# Altium schematic sheet PSU.SchDoc
size A3
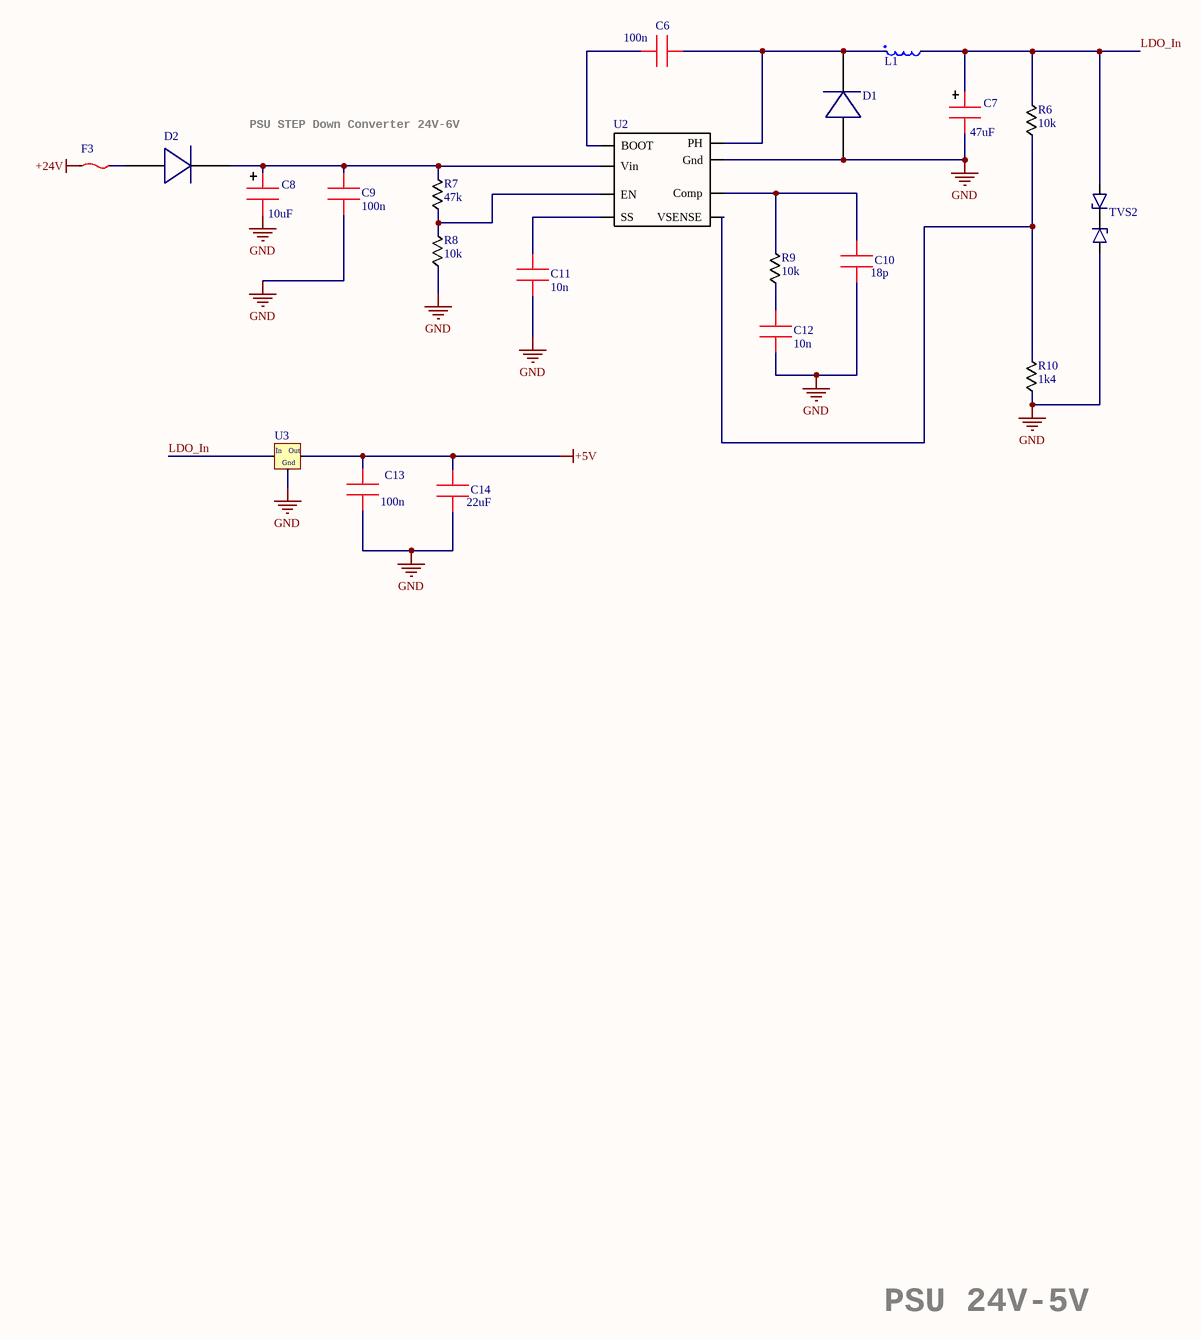
[diagram p0: PSU.SchDoc]

## Parts
C6  100n  [0603 - Cap]
C7  47uF  [1210]
C8  10uF  [1210]
C9  100n  [0603 - Cap]
C10  18p  [0603 - Cap]
C11  10n  [0603 - Cap]
C12  10n  [0603 - Cap]
C13  100n  [0603 - Cap]
C14  22uF  [1206]
D1  (no value)  [B340A-13-F]
D2  (no value)  [B340A-13-F]
F3  (no value)  [MSMF]
L1  (no value)  [SRU1048]
R6  10k  [0603_Res]
R7  47k  [0603_Res]
R8  10k  [0603_Res]
R9  10k  [0603_Res]
R10  1k4  [0603_Res]
TVS2  (no value)  [SM6T]
U2  (no value)  [SOIC 8]
U3  (no value)  [SOT223]

## Nets
+5V: C13.1 C14.2 U3.2(OUT)
+24V: F3.0
GND: C7.2 C8.2 C9.1 C10.1 C11.1 C12.1 C13.2 C14.1 D1.2 R8.1 R10.1 TVS2.1 U2.7(Gnd) U3.1(GND)
LDO_In: C7.1 L1.2 R6.2 TVS2.2 U3.3(IN)
NetC6_1: C6.1 U2.1(BOOT)
NetC6_2: C6.2 D1.1 L1.1 U2.8(PH)
NetC8_1: C8.1 C9.2 D2.1 R7.2 U2.2(Vin)
NetC10_2: C10.2 R9.2 U2.6(Comp)
NetC11_2: C11.2 U2.4(SS)
NetC12_2: C12.2 R9.1
NetD2_2: D2.2 F3.1
NetR6_1: R6.1 R10.2 U2.5(VSENSE)
NetR7_1: R7.1 R8.2 U2.3(EN)

## Notes on the sheet
- PSU STEP Down Converter 24V-6V
- PSU 24V-5V
- (in symbol NCV1117ST50T3G) In; Out; Gnd

## Library data of the parts
C6 C9 = 0805 Cap: Part Description: Ceramic Capacitors SMD 50 V 0.1uF X7R 0603 10%; Part Number: CC0603KRX7R9BB104
C7 = 1206 Cap El: Part Description: Capacitor - SMD 47 uF 10 VDC 10% 1210 X7R; Part Number: GRM32ER71A476KE15L
C8 = 1206 Cap El: Part Description: Ceramic Capacitors SMD 10UF 50V 10% 1210; Part Number: GRM32ER71H106KA12L
C10 = 0805 Cap: Part Description: Cap SMD/SMT 50 V 18 pF C0G 0603 5%; Part Number: CC0603JRNPO9BN180
C11 C12 = 0805 Cap: Part Description: Capacitor SMD 0.01 uF 50 VDC 5% 0603 C0G (NP0); Part Number: GRM1885C1H103JA01D
C13 = Capasitor 0805: CC0603ZRY5V9BB104; Part Description: Ceramic Capacitors SMD 50 V 0.1uF X7R 0603 10%; Part Number: CC0603KRX7R9BB104
C14 = 0805 Cap: Part Description: Cap SMD 16V 22uF X5R 1210 10%; Part Number: CC1210KKX5R7BB226
D1 D2 = B340A-13-F: Part Description: Schottky Diode 60V 3A; Part Number: B360A-13-F
F3 = MSMF: Part Description: PPTC 60V 100MA; Part Number: MF-MSMF010-2
L1 = CDRH127: Part Description: Power Inductor SMD 33uH 30% SMD 1048; Part Number: SRU1048-330Y
R6 R8 R9 = Resistor 0805: Part Description: SMD  Resistor 0603, 10kOhms, 1%, 1/10W; Part Number: RC0603FR-0710KL
R7 = Resistor 0805: RC0603JR-0747K; Part Description: SMD Resistor 0603, 47kOhms, 5%, 1/10W; Part Number: RC0603JR-0747K
R10 = Resistor 0805: Part Description: Thick Film Resistor 0603, 1.4kOhms, 1%, 1/10W; Part Number: RC0603FR-071K4L
TVS2 = SM6T: Part Description: ESD TVS Diode 600W 12V Bidirect; Part Number: SM6T12CA
U2 = TPS54331: Part Description: Switching Voltage Regulators 3A 28V; Part Number: TPS54331
U3 = NCV1117ST50T3G: Part Description: LDO 5V 800MA; Part Number: LM1117MPX-5.0